# Altium schematic sheet REVERSE_PROTECTION.SchDoc
size A4; SheetNumber: 3; SheetTotal: 13
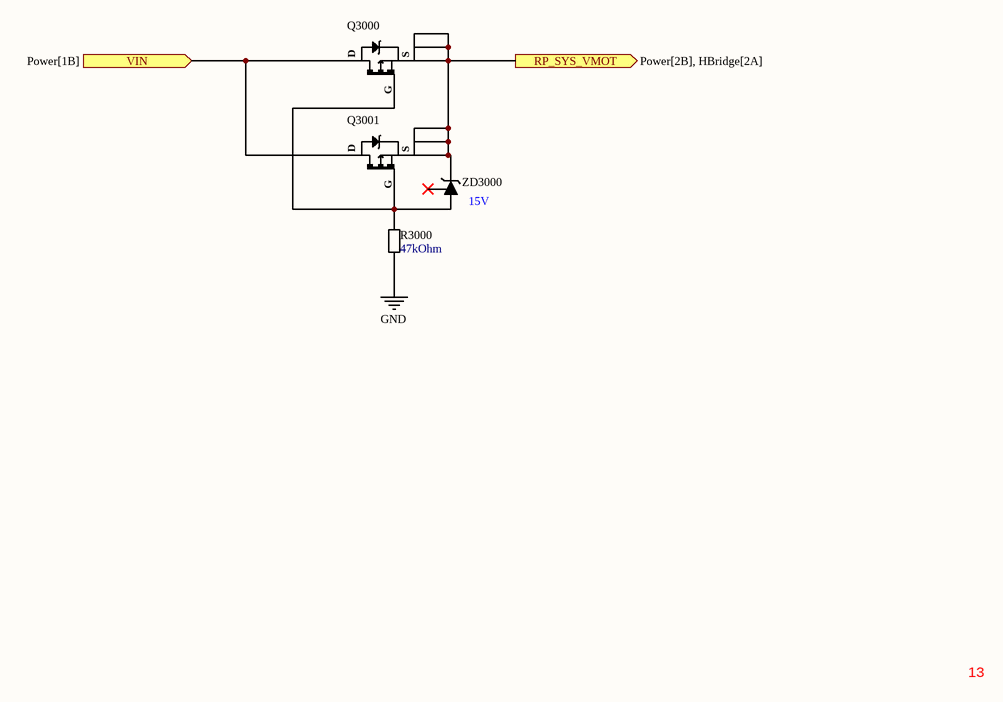
[diagram p0: REVERSE_PROTECTION.SchDoc]

## Parts
Q3000  SQJ659EP PMOS  [PowerPAK SO-8L SINGLE]  (value not drawn)
Q3001  SQJ659EP PMOS  [PowerPAK SO-8L SINGLE]  (value not drawn)
R3000  47kOhm  [RES_0603]
ZD3000  DZ23C15-E3-08 Zener Diode  [SOT95P245X96-3N]  (value not drawn)

## Ports
RP_SYS_VMOT (out, see Power[2B], HBridge[2A]), VIN (in, see Power[1B])

## Nets
GND: R3000.1
RP_SYS_VMOT: Q3000.S(S1) Q3001.S(S1) ZD3000.3(Cathode) ; port RP_SYS_VMOT
VIN: Q3000.D Q3001.D ; port VIN
NetQ3000_G: Q3000.G Q3001.G R3000.2 ZD3000.1(Anode)

Not connected (* = marked no-connect by the designer): ZD3000 2(Anode)*

## Notes on the sheet
- (near ZD3000) 15V
- 13

## Library data of the parts
Q3000 Q3001 = 00000005: P-Channel 60 V 52A (Tc) 83W (Tc) Surface Mount PowerPAK® SO-8; DigiKey Part Number: SQJ459EP-T1_GE3CT-ND; Mouser Part Number: 78-SQJ459EP-T2_BE3; ComponentLink1Description: DigiKey; ComponentLink1URL: https://www.digikey.com/en/products/detail/vishay-siliconix/SQJ459EP-T1-GE3/6708881; ComponentLink2Description: Mouser; ComponentLink2URL: https://eu.mouser.com/ProductDetail/Vishay-Siliconix/SQJ459EP-T2_BE3?qs=CiayqK2gdcKpg8h0vLRPjA%3D%3D
R3000 = R000010: 47 kOhms ±1% 0.1W, 1/10W Chip Resistor 0603 (1608 Metric) Moisture Resistant Thick Film; ComponentLink1Description: DigiKey; ComponentLink1URL: https://www.digikey.com/en/products/detail/yageo/RC0603FR-0747KL/727253; resistance: 47kOhm; DigiKey Part Number: 311-47.0KHRCT-ND
ZD3000 = 00000006: Zener Diode Array 1 Pair Common Cathode 15 V 300 mW ±5% SOT-23-3; DigiKey Part Number: 112-DZ23C15-E3-08CT-ND; ComponentLink1Description: DigiKey; ComponentLink1URL: https://www.digikey.com/en/products/detail/vishay-general-semiconductor-diodes-division/DZ23C15-E3-08/4831460